# EAGLE design W707L (EAGLE 6.6.0)
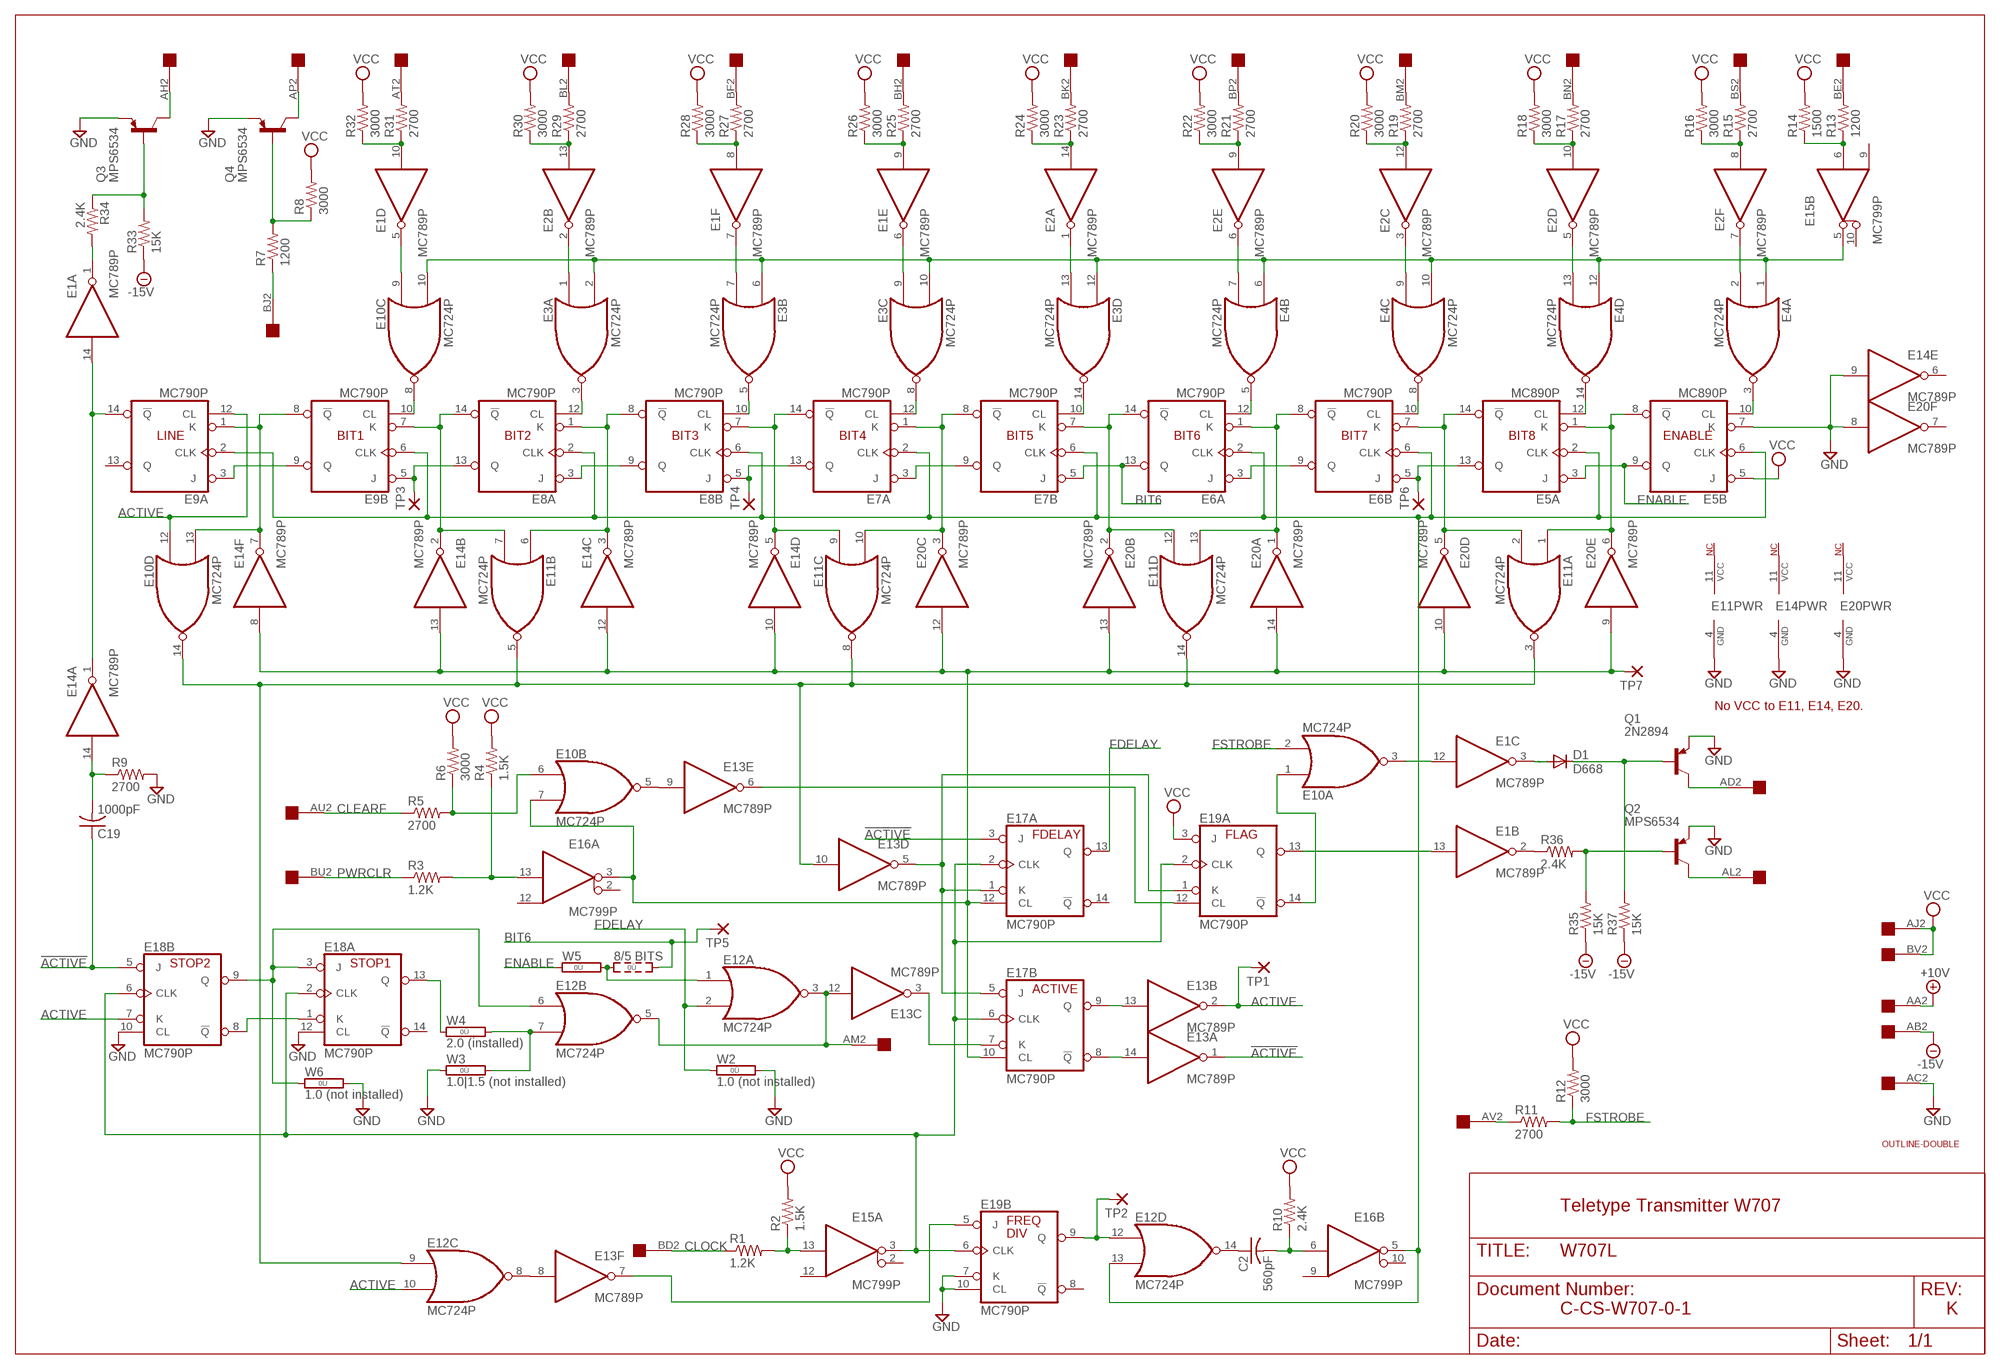
[diagram p0: schematic, sheet 1]

## Parts
C2  560pF  C-US050-025X075  [C050-025X075]
C19  1000pF  C-US050-025X075  [C050-025X075]
D1  D668  1N4148DO35-10  [DO35-10]
E1  MC789P  MC889P  [DIL14]
E2  MC789P  MC889P  [DIL14]
E3  MC724P  MC824P  [DIL14]
E4  MC724P  MC824P  [DIL14]
E5  MC890P  [DIL14]
E6  MC790P  MC890P  [DIL14]
E7  MC790P  MC890P  [DIL14]
E8  MC790P  MC890P  [DIL14]
E9  MC790P  MC890P  [DIL14]
E10  MC724P  MC824P  [DIL14]
E11  MC724P  MC824P  [DIL14]
E12  MC724P  MC824P  [DIL14]
E13  MC789P  MC889P  [DIL14]
E14  MC789P  MC889P  [DIL14]
E15  MC799P  MC899P  [DIL14]
E16  MC799P  MC899P  [DIL14]
E17  MC790P  MC890P  [DIL14]
E18  MC790P  MC890P  [DIL14]
E19  MC790P  MC890P  [DIL14]
E20  MC789P  MC889P  [DIL14]
Q1  2N2894  2N2904  [TO39]
Q2  MPS6534  2N2904  [TO39]
Q3  MPS6534  2N2904  [TO39]
Q4  MPS6534  2N2904  [TO39]
R1  1.2K  R-US_0207/10  [0207/10]
R2  1.5K  R-US_0207/10  [0207/10]
R3  1.2K  R-US_0207/10  [0207/10]
R4  1.5K  R-US_0207/10  [0207/10]
R5  2700  R-US_0207/10  [0207/10]
R6  3000  R-US_0207/10  [0207/10]
R7  1200  R-US_0207/10  [0207/10]
R8  3000  R-US_0207/10  [0207/10]
R9  2700  R-US_0207/10  [0207/10]
R10  2.4K  R-US_0207/10  [0207/10]
R11  2700  R-US_0207/10  [0207/10]
R12  3000  R-US_0207/10  [0207/10]
R13  1200  R-US_0207/10  [0207/10]
R14  1500  R-US_0207/10  [0207/10]
R15  2700  R-US_0207/10  [0207/10]
R16  3000  R-US_0207/10  [0207/10]
R17  2700  R-US_0207/10  [0207/10]
R18  3000  R-US_0207/10  [0207/10]
R19  2700  R-US_0207/10  [0207/10]
R20  3000  R-US_0207/10  [0207/10]
R21  2700  R-US_0207/10  [0207/10]
R22  3000  R-US_0207/10  [0207/10]
R23  2700  R-US_0207/10  [0207/10]
R24  3000  R-US_0207/10  [0207/10]
R25  2700  R-US_0207/10  [0207/10]
R26  3000  R-US_0207/10  [0207/10]
R27  2700  R-US_0207/10  [0207/10]
R28  3000  R-US_0207/10  [0207/10]
R29  2700  R-US_0207/10  [0207/10]
R30  3000  R-US_0207/10  [0207/10]
R31  2700  R-US_0207/10  [0207/10]
R32  3000  R-US_0207/10  [0207/10]
R33  15K  R-US_0207/10  [0207/10]
R34  2.4K  R-US_0207/10  [0207/10]
R35  15K  R-US_0207/10  [0207/10]
R36  2.4K  R-US_0207/10  [0207/10]
R37  15K  R-US_0207/10  [0207/10]
TP1  3,17/1,3  [3,17/1,3]
TP2  3,17/1,3  [3,17/1,3]
TP3  3,17/1,3  [3,17/1,3]
TP4  3,17/1,3  [3,17/1,3]
TP5  3,17/1,3  [3,17/1,3]
TP6  3,17/1,3  [3,17/1,3]
TP7  3,17/1,3  [3,17/1,3]
U$1  OUTLINE-DOUBLE  [DOUBLE]
U$2  DOUBLE  [EDGE-CON4]
W2  1.0 (not installed)  0R  [0R/10]
W3  1.0|1.5 (not installed)  0R  [0R/10]
W4  2.0 (installed)  0R  [0R/10]
W5  8/5 BITS  0R2  [0R2/10]
W6  1.0 (not installed)  0R  [0R/10]

## Nets
!ACTIVE: C19.1 E13.1(A:O) E17.3(A:J) E18.5(B:J)
+10V [Supply]: U$2.AA2
-15V [Supply]: R33.1 R35.1 R37.1 U$2.AB2
ACTIVE: E9.12(A:CL) E10.12(D:I0) E12.10(C:I1) E13.2(B:O) E18.7(B:K) TP1.1(P)
BIT6: E6.13(A:Q) E7.5(B:J) TP5.1(P) W5.3
CLEARF: R5.1 U$2.AU2
CLOCK: R1.1 U$2.BD2
ENABLE: E5.3(A:J) E5.9(B:Q) W5.1
FDELAY: E12.2(A:I1) E17.13(A:Q) W2.1
FSTROBE: E10.2(A:I1) R11.2 R12.1
GND [Supply]: E5.7(B:K) E11.4(PWR:GND) E14.4(PWR:GND) E14.9(E:I) E18.10(B:CL) E18.12(A:CL) E19.7(B:K) E19.10(B:CL) E20.4(PWR:GND) E20.8(F:I) Q1.1(E) Q2.1(E) Q3.1(E) Q4.1(E) R9.2 U$2.AC2 W2.2 W3.1 W6.2
N$1: E1.5(D:O) E10.9(C:I0)
N$2: E2.2(B:O) E3.1(A:I0)
N$3: E1.7(F:O) E3.7(B:I1)
N$4: E1.6(E:O) E3.9(C:I0)
N$5: E2.1(A:O) E3.13(D:I1)
N$6: E2.6(E:O) E4.7(B:I1)
N$7: E2.3(C:O) E4.9(C:I0)
N$8: E2.5(D:O) E4.13(D:I1)
N$9: E2.7(F:O) E4.2(A:I1)
N$10: R31.2 U$2.AT2
N$11: R29.2 U$2.BL2
N$12: R27.2 U$2.BF2
N$13: E1.10(D:I) R31.1 R32.1
N$14: E1.8(F:I) R27.1 R28.1
N$15: R25.2 U$2.BH2
N$16: E1.9(E:I) R25.1 R26.1
N$17: R23.2 U$2.BK2
N$18: E2.14(A:I) R23.1 R24.1
N$19: E2.9(E:I) R21.1 R22.1
N$20: R21.2 U$2.BP2
N$21: R19.2 U$2.BM2
N$22: R17.2 U$2.BN2
N$23: R15.2 U$2.BS2
N$24: E2.13(B:I) R29.1 R30.1
N$25: E15.3(A:O) E17.2(A:CLK) E17.6(B:CLK) E18.2(A:CLK) E18.6(B:CLK) E19.2(A:CLK) E19.6(B:CLK)
N$26: E2.12(C:I) R19.1 R20.1
N$27: E2.10(D:I) R17.1 R18.1
N$28: E2.8(F:I) R15.1 R16.1
N$29: R13.2 U$2.BE2
N$30: E15.6(B:I) R13.1 R14.1
N$31: E3.2(A:I1) E3.6(B:I0) E3.10(C:I1) E3.12(D:I0) E4.1(A:I0) E4.6(B:I0) E4.10(C:I1) E4.12(D:I0) E10.10(C:I1) E15.5(B:O)
N$32: E5.2(A:CLK) E5.6(B:CLK) E6.2(A:CLK) E6.6(B:CLK) E7.2(A:CLK) E7.6(B:CLK) E8.2(A:CLK) E8.6(B:CLK) E9.2(A:CLK) E9.6(B:CLK) E12.13(D:I1) E16.5(B:O)
N$33: E8.1(A:K) E8.8(B:!Q) E11.6(B:I0) E14.3(C:O)
N$34: E8.3(A:J) E8.9(B:Q)
N$35: E7.14(A:!Q) E8.7(B:K) E11.9(C:I0) E14.5(D:O)
N$36: E7.13(A:Q) E8.5(B:J) TP4.1(P)
N$37: E7.3(A:J) E7.9(B:Q)
N$38: E7.1(A:K) E7.8(B:!Q) E11.10(C:I1) E20.3(C:O)
N$39: E6.14(A:!Q) E7.7(B:K) E11.12(D:I0) E20.2(B:O)
N$40: E12.1(A:I0) W5.2
N$41: E6.1(A:K) E6.8(B:!Q) E11.13(D:I1) E20.1(A:O)
N$42: E6.3(A:J) E6.9(B:Q)
N$43: E5.14(A:!Q) E6.7(B:K) E11.2(A:I1) E20.5(D:O)
N$44: E5.13(A:Q) E6.5(B:J) TP6.1(P)
N$45: E5.1(A:K) E5.8(B:!Q) E11.1(A:I0) E20.6(E:O)
N$46: Q4.3(C) U$2.AP2
N$47: E4.3(A:O) E5.10(B:CL)
N$48: E3.14(D:O) E7.10(B:CL)
N$49: E4.5(B:O) E6.12(A:CL)
N$50: E4.8(C:O) E6.10(B:CL)
N$51: E4.14(D:O) E5.12(A:CL)
N$52: E3.8(C:O) E7.12(A:CL)
N$53: E13.7(F:O) E19.5(B:J)
N$54: E8.14(A:!Q) E9.7(B:K) E11.7(B:I1) E14.2(B:O)
N$55: E8.13(A:Q) E9.5(B:J) TP3.1(P)
N$56: E9.10(B:CL) E10.8(C:O)
N$57: E3.5(B:O) E8.10(B:CL)
N$58: E15.13(A:I) R1.2 R2.1
N$59: E16.13(A:I) R3.2 R4.1
N$60: E3.3(A:O) E8.12(A:CL)
N$61: E9.1(A:K) E9.8(B:!Q) E10.13(D:I1) E14.7(F:O)
N$62: E9.3(A:J) E9.9(B:Q)
N$63: E1.14(A:I) E9.14(A:!Q) E14.1(A:O)
N$64: E1.1(A:O) R34.2
N$65: Q3.2(B) R33.2 R34.1
N$66: E10.7(B:I1) E14.8(F:I) E14.10(D:I) E14.12(C:I) E14.13(B:I) E16.3(A:O) E17.10(B:CL) E17.12(A:CL) E20.9(E:I) E20.10(D:I) E20.12(C:I) E20.13(B:I) E20.14(A:I) TP7.1(P)
N$67: Q3.3(C) U$2.AH2
N$68: E10.14(D:O) E11.3(A:O) E11.5(B:O) E11.8(C:O) E11.14(D:O) E12.9(C:I0) E13.10(D:I)
N$69: E12.12(D:I0) E19.9(B:Q) TP2.1(P)
N$71: C2.1 E12.14(D:O)
N$72: C2.2 E16.6(B:I) R10.1
N$73: E12.8(C:O) E13.8(F:I)
N$74: E13.14(A:I) E17.8(B:!Q)
N$75: E13.13(B:I) E17.9(B:Q)
N$76: E18.13(A:Q) W4.1
N$77: E13.3(C:O) E17.7(B:K)
N$78: E12.3(A:O) E12.5(B:O) E13.12(C:I) U$2.AM2
N$79: Q4.2(B) R7.2 R8.1
N$80: E12.6(B:I0) E18.3(A:J) E18.9(B:Q) W6.1
N$81: E10.1(A:I0) E19.14(A:!Q)
N$82: E12.7(B:I1) W3.2 W4.2
N$83: R7.1 U$2.BJ2
N$84: R11.1 U$2.AV2
N$85: E10.5(B:O) E13.9(E:I)
N$86: Q2.2(B) R35.2 R36.2
N$87: Q2.3(C) U$2.AL2
N$88: Q1.3(C) U$2.AD2
N$89: D1.C Q1.2(B) R37.2
N$90: D1.A E1.3(C:O)
N$91: E1.2(B:O) R36.1
N$92: E1.12(C:I) E10.3(A:O)
N$93: C19.2 E14.14(A:I) R9.1
N$94: E13.5(D:O) E17.1(A:K) E17.5(B:J) E19.1(A:K)
N$96: E13.6(E:O) E19.12(A:CL)
N$97: E1.13(B:I) E19.13(A:Q)
N$98: E18.1(A:K) E18.8(B:!Q)
N$105: E10.6(B:I0) R5.2 R6.1
NC: E11.11(PWR:VCC) E14.11(PWR:VCC) E20.11(PWR:VCC)
PWRCLR: R3.1 U$2.BU2
VCC [Supply]: E5.5(B:J) E19.3(A:J) R2.2 R4.2 R6.2 R8.2 R10.2 R12.2 R14.2 R16.2 R18.2 R20.2 R22.2 R24.2 R26.2 R28.2 R30.2 R32.2 U$2.AJ2 U$2.BV2
Unconnected: E9.13(A:Q) E14.6(E:O) E15.2(A:E) E15.9(B:R) E15.10(B:E) E15.12(A:R) E16.2(A:E) E16.9(B:R) E16.10(B:E) E16.12(A:R) E17.14(A:!Q) E18.14(A:!Q) E19.8(B:!Q) E20.7(F:O) U$2.AA1 U$2.AB1 U$2.AC1 U$2.AD1 U$2.AE1 U$2.AE2 U$2.AF1 U$2.AF2 U$2.AH1 U$2.AJ1 U$2.AK1 U$2.AK2 U$2.AL1 U$2.AM1 U$2.AN1 U$2.AN2 U$2.AP1 U$2.AR1 U$2.AR2 U$2.AS1 U$2.AS2 U$2.AT1 U$2.AU1 U$2.AV1 U$2.BA1 U$2.BA2 U$2.BB1 U$2.BB2 U$2.BC1 U$2.BC2 U$2.BD1 U$2.BE1 U$2.BF1 U$2.BH1 U$2.BJ1 U$2.BK1 U$2.BL1 U$2.BM1 U$2.BN1 U$2.BP1 U$2.BR1 U$2.BR2 U$2.BS1 U$2.BT1 U$2.BT2 U$2.BU1 U$2.BV1

## Notes on the sheet
- LINE | BIT1 | BIT2 | BIT3 | BIT4 | BIT5 | BIT6 | BIT7 | BIT8 | ENABLE
- No VCC to E11, E14, E20.
- FDELAY | FLAG
- STOP2 | STOP1
- ACTIVE
- Teletype Transmitter W707
- FREQ
- DIV
- C-CS-W707-0-1 | K

## Power pins joined to a net without a drawn wire
GND: E1.4(PWR:GND) E2.4(PWR:GND) E3.4(PWR:GND) E4.4(PWR:GND) E5.4(PWR:GND) E6.4(PWR:GND) E7.4(PWR:GND) E8.4(PWR:GND) E9.4(PWR:GND) E10.4(PWR:GND) E12.4(PWR:GND) E13.4(PWR:GND) E15.4(PWR:GND) E16.4(PWR:GND) E17.4(PWR:GND) E18.4(PWR:GND) E19.4(PWR:GND)
VCC: E1.11(PWR:VCC) E2.11(PWR:VCC) E3.11(PWR:VCC) E4.11(PWR:VCC) E5.11(PWR:VCC) E6.11(PWR:VCC) E7.11(PWR:VCC) E8.11(PWR:VCC) E9.11(PWR:VCC) E10.11(PWR:VCC) E12.11(PWR:VCC) E13.11(PWR:VCC) E15.11(PWR:VCC) E16.11(PWR:VCC) E17.11(PWR:VCC) E18.11(PWR:VCC) E19.11(PWR:VCC)

## Library data of the parts
C2 C19 = rcl:C-US: CAPACITOR, American symbol
D1 = diode:1N4148: DIODE high speed (Philips)
E1 E2 E13 E14 E20 = dec-con:MC889: RTL Hex Inverter
E3 E4 E10-E12 = dec-con:MC824: RTL Quad NOR Gate
E5-E9 E17-E19 = dec-con:MC890: RTL Dual JK Flip-Flop
E15 E16 = dec-con:MC899: RTL Dual Buffer
Q1-Q4 = transistor-pnp:2N2904*: PNP Transistror
R1-R37 = rcl:R-US_: RESISTOR, American symbol
TP1-TP7 = wirepad:3,17/1,3: THROUGH-HOLE PAD
U$1 = dec-con:OUTLINE-*: Board outlines for DEC boards.
U$2 = dec-con:DOUBLE: Double-Height DEC board
W2-W4 W6 = jumper:0R: Bridge 0R 10mm
W5 = jumper:0R2: Bridge switch 0R 2 x 10mm

## Net classes
1 Supply: width 0.813 mm

## Board
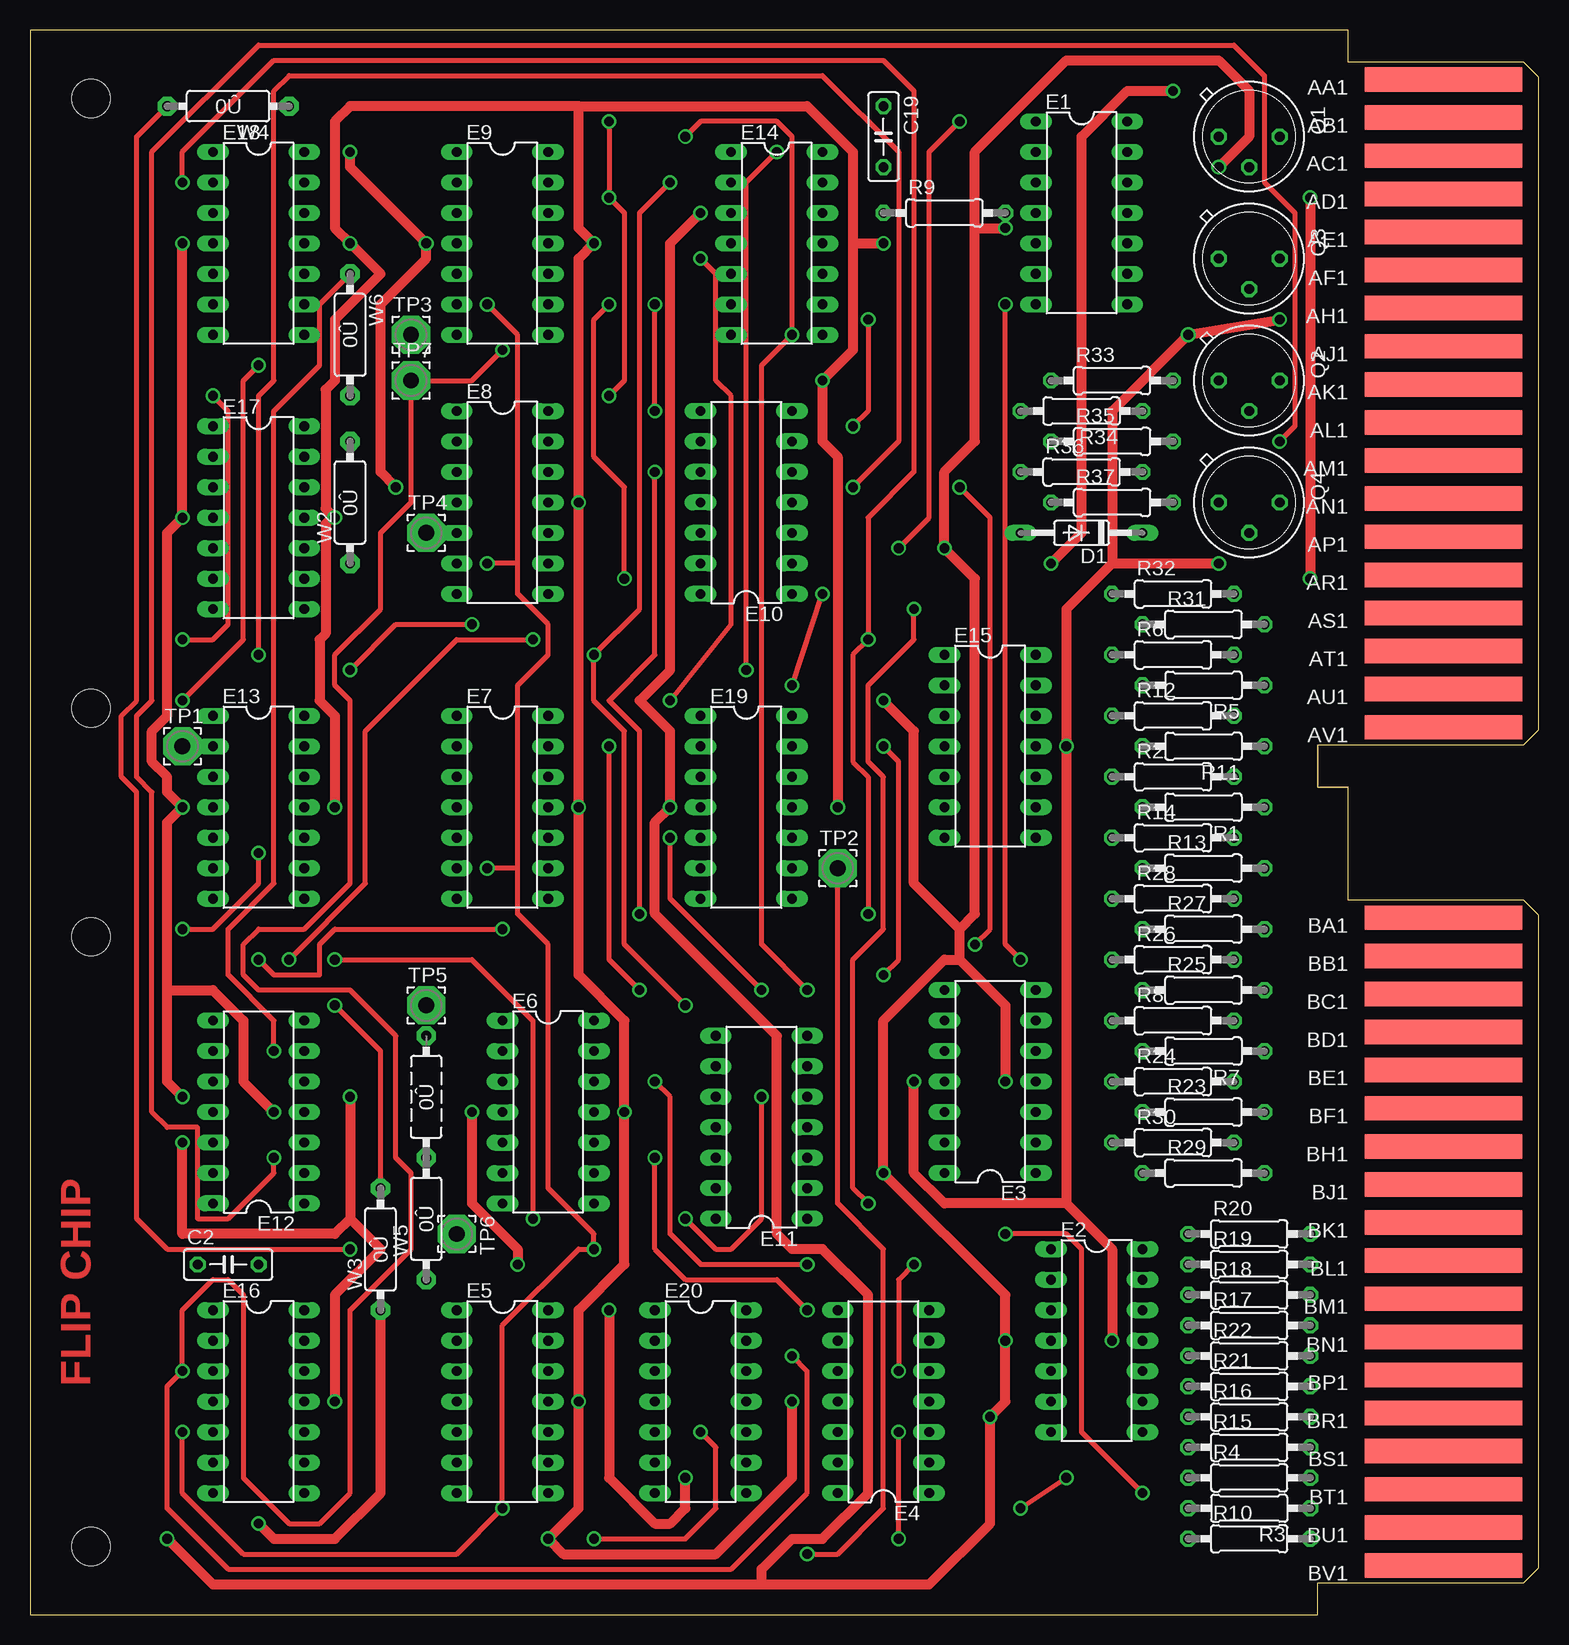
[diagram p1: board, top side]
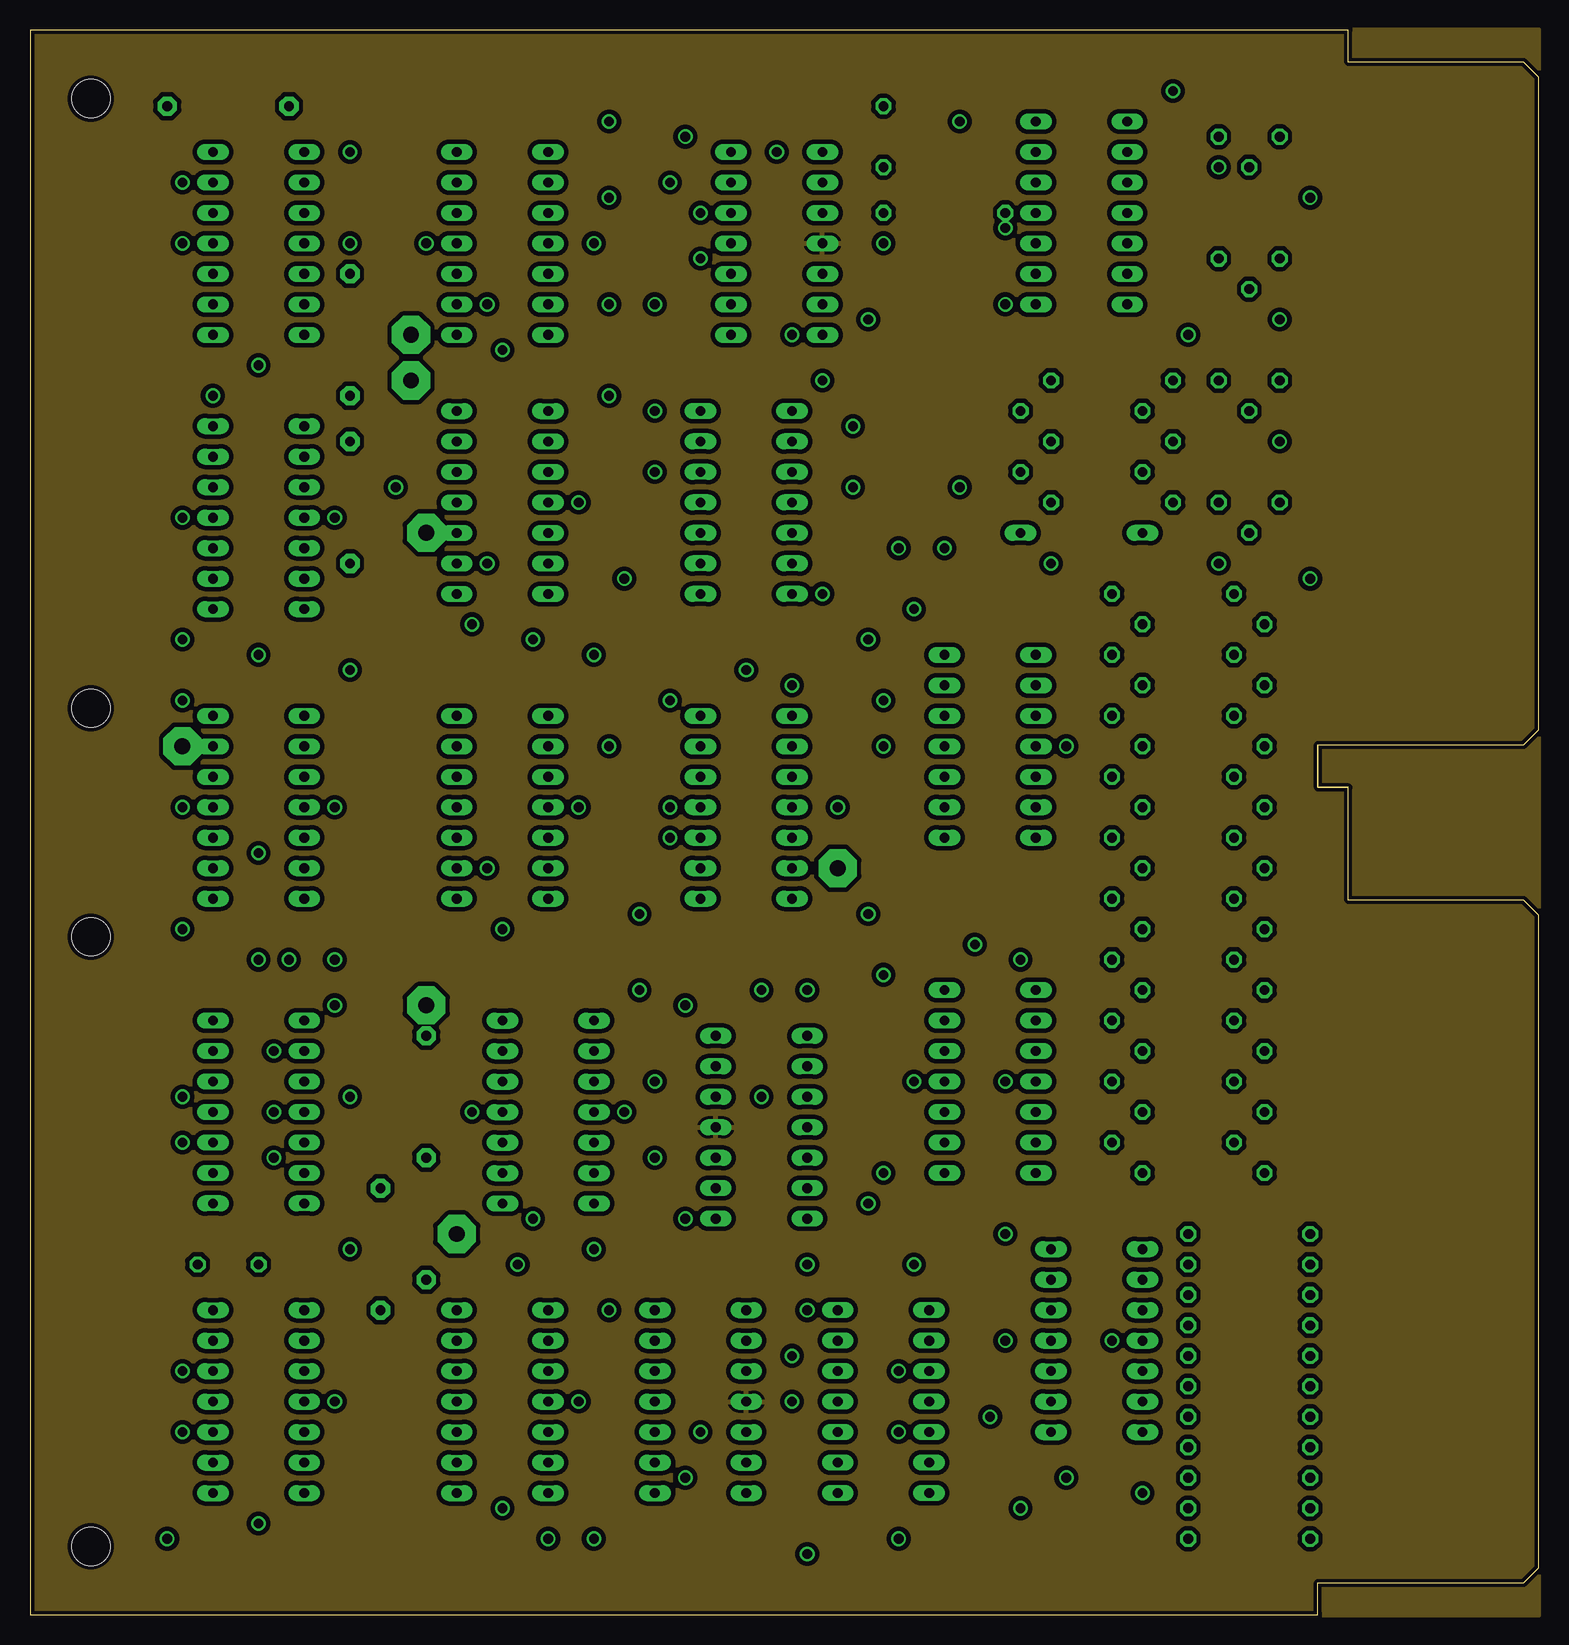
[diagram p2: board, inner layer NC$]
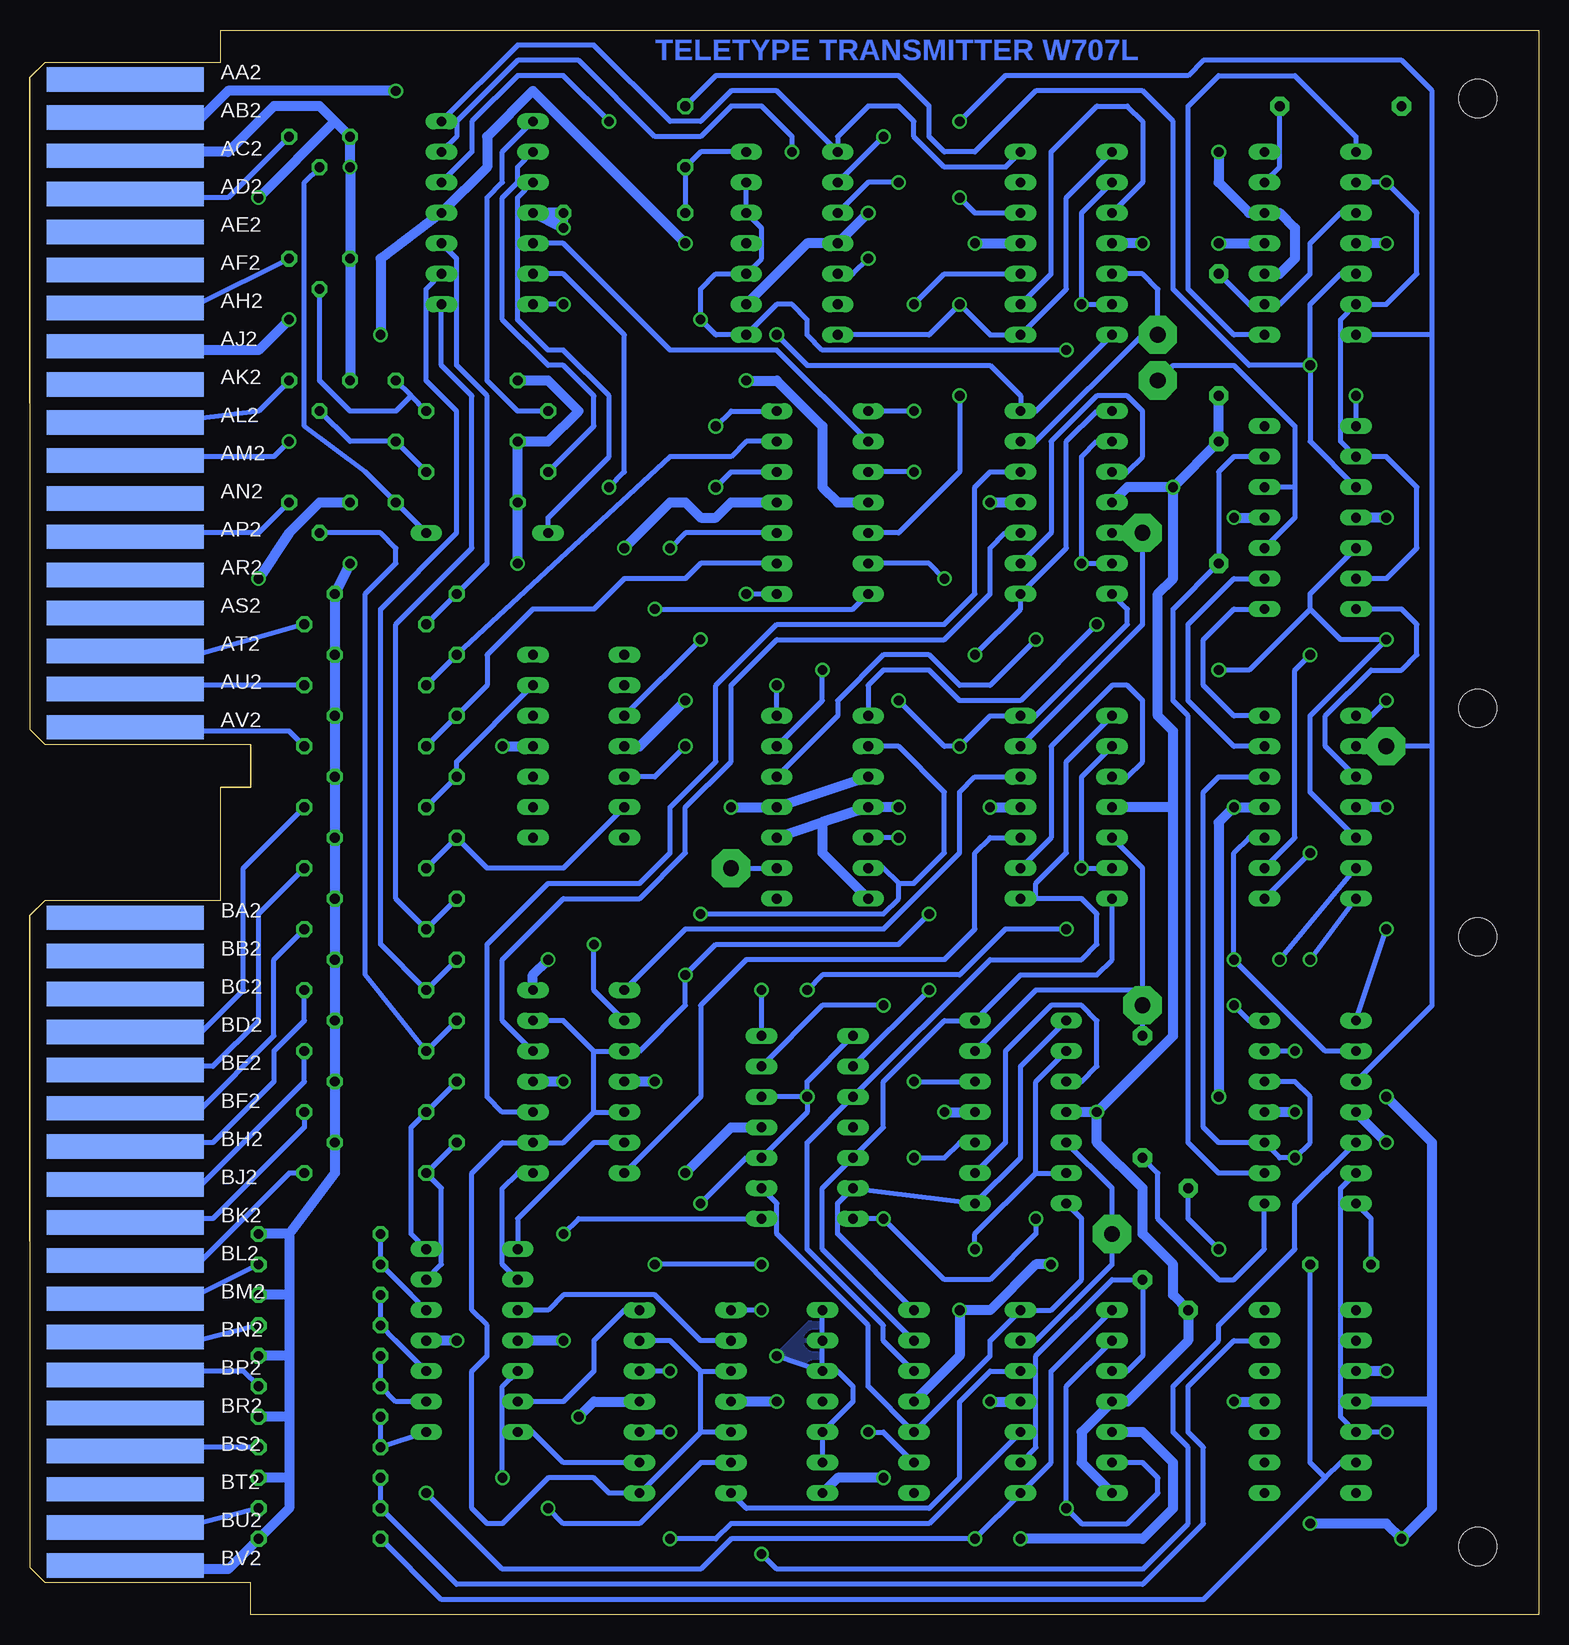
[diagram p3: board, bottom side, seen from below]

Size 125.73 x 132.08 mm. Coordinates in mm from the lower left corner, seen from the top.
Copper layers (1+2+16): Top 0.035mm / dielectric 1.5mm / NC$ 0.035mm / dielectric 0.15mm / Bottom 0.035mm
Design rules "16mils *": minimum track width 16mil, minimum drill 32mil, track to track 15mil, track to pad 10mil, pad to pad 10mil, via to via 10mil, smd to smd 10mil, copper to edge 13mil, drill to drill 10mil, minimum pad ring 10mil, minimum via ring 8mil, stop-mask expansion 0mil, vias tented up to drill 0mil, thermal gap 10mil

### Footprints (pad centres in the part's own frame; a part is rotated, then mirrored left to right if it is on the bottom)
C050-025X075 = drill 0.813 octagon: 1 -2.54,0; 2 2.54,0
DO35-10 = drill 0.813 long: A 5.08,0; C -5.08,0
DIL14 = drill 0.813 long: 1 -7.62,-3.81; 2 -5.08,-3.81; 3 -2.54,-3.81; 4 0,-3.81; 5 2.54,-3.81; 6 5.08,-3.81; 7 7.62,-3.81; 8 7.62,3.81; 9 5.08,3.81; 10 2.54,3.81; 11 0,3.81; 12 -2.54,3.81; 13 -5.08,3.81; 14 -7.62,3.81
TO39 = drill 0.813 octagon: 1 0,-2.54; 2 2.54,0; 3 0,2.54
0207/10 = drill 0.813 octagon: 1 -5.08,0; 2 5.08,0
3,17/1,3 = drill 1.321 pad 3.175 octagon: 1 0,0
DOUBLE = hole 3.175: 120.65,56.515; 120.65,5.715; 120.65,75.565; 120.65,126.365
EDGE-CON4 = smd 13.106 x 2.032: AA1 7.938,4.128; AB1 7.938,7.303; AC1 7.938,10.477; AD1 7.938,13.652; AE1 7.938,16.828; AF1 7.938,20.003; AH1 7.938,23.177; AJ1 7.938,26.352; AK1 7.938,29.527; AL1 7.938,32.703; AM1 7.938,35.877; AN1 7.938,39.053; AP1 7.938,42.227; AR1 7.938,45.403; AS1 7.938,48.578; AT1 7.938,51.752; AU1 7.938,54.928; AV1 7.938,58.102; BA1 7.938,73.978; BB1 7.938,77.153; BC1 7.938,80.328; BD1 7.938,83.502; BE1 7.938,86.677; BF1 7.938,89.853; BH1 7.938,93.028; BJ1 7.938,96.203; BK1 7.938,99.377; BL1 7.938,102.552; BM1 7.938,105.728; BN1 7.938,108.903; BP1 7.938,112.078; BR1 7.938,115.252; BS1 7.938,118.427; BT1 7.938,121.603; BU1 7.938,124.778; BV1 7.938,127.953 | smd 13.106 x 2.032 bottom: AA2 7.938,4.128; AB2 7.938,7.303; AC2 7.938,10.477; AD2 7.938,13.652; AE2 7.938,16.828; AF2 7.938,20.003; AH2 7.938,23.177; AJ2 7.938,26.352; AK2 7.938,29.527; AL2 7.938,32.703; AM2 7.938,35.877; AN2 7.938,39.053; AP2 7.938,42.227; AR2 7.938,45.403; AS2 7.938,48.578; AT2 7.938,51.752; AU2 7.938,54.928; AV2 7.938,58.102; BA2 7.938,73.978; BB2 7.938,77.153; BC2 7.938,80.328; BD2 7.938,83.502; BE2 7.938,86.677; BF2 7.938,89.853; BH2 7.938,93.028; BJ2 7.938,96.203; BK2 7.938,99.377; BL2 7.938,102.552; BM2 7.938,105.728; BN2 7.938,108.903; BP2 7.938,112.078; BR2 7.938,115.252; BS2 7.938,118.427; BT2 7.938,121.603; BU2 7.938,124.778; BV2 7.938,127.953
0R/10 = drill 0.813 pad 1.6 octagon: 1 -5.08,0; 2 5.08,0
0R2/10 = drill 0.813 pad 1.6 octagon: 1 -5.08,0; 2 5.08,0; 3 15.24,0

### Placement (x,y rotation side)
C2  16.51,29.21 0 top
C19  71.12,123.19 270 top
D1  87.63,90.17 180 top
E1  87.63,116.84 270 top
E2  88.9,22.86 270 top
E3  80.01,44.45 90 top
E4  71.12,17.78 90 top
E5  39.37,17.78 270 top
E6  43.18,41.91 270 top
E7  39.37,67.31 270 top
E8  39.37,92.71 270 top
E9  39.37,114.3 270 top
E10  59.69,92.71 90 top
E11  60.96,40.64 90 top
E12  19.05,41.91 90 top
E13  19.05,67.31 270 top
E14  62.23,114.3 270 top
E15  80.01,72.39 270 top
E16  19.05,17.78 270 top
E17  19.05,91.44 270 top
E18  19.05,114.3 270 top
E19  59.69,67.31 270 top
E20  55.88,17.78 270 top
Q1  101.6,123.19 270 top
Q2  101.6,102.87 270 top
Q3  101.6,113.03 270 top
Q4  101.6,92.71 270 top
R1  97.79,67.31 180 top
R2  95.25,69.85 0 top
R3  101.6,8.89 180 top
R4  101.6,11.43 0 top
R5  97.79,77.47 180 top
R6  95.25,80.01 0 top
R7  97.79,46.99 180 top
R8  95.25,49.53 0 top
R9  76.2,116.84 0 top
R10  101.6,6.35 0 top
R11  97.79,72.39 180 top
R12  95.25,74.93 0 top
R13  97.79,62.23 0 top
R14  95.25,64.77 0 top
R15  101.6,13.97 0 top
R16  101.6,16.51 0 top
R17  101.6,24.13 0 top
R18  101.6,26.67 0 top
R19  101.6,29.21 0 top
R20  101.6,31.75 0 top
R21  101.6,19.05 0 top
R22  101.6,21.59 0 top
R23  97.79,41.91 0 top
R24  95.25,44.45 0 top
R25  97.79,52.07 0 top
R26  95.25,54.61 0 top
R27  97.79,57.15 0 top
R28  95.25,59.69 0 top
R29  97.79,36.83 0 top
R30  95.25,39.37 0 top
R31  97.79,82.55 0 top
R32  95.25,85.09 0 top
R33  90.17,102.87 0 top
R34  87.63,100.33 180 top
R35  90.17,97.79 0 top
R36  87.63,95.25 0 top
R37  90.17,92.71 0 top
TP1  12.7,72.39 0 top
TP2  67.31,62.23 0 top
TP3  31.75,106.68 0 top
TP4  33.02,90.17 0 top
TP5  33.02,50.8 0 top
TP6  35.56,31.75 270 top
TP7  31.75,102.87 0 top
U$1  125.73,132.08 180 top
U$2  125.73,132.08 180 top
U$3  [FLIPCHIP]  0,0 0 top
W2  26.67,92.71 90 top
W3  29.21,30.48 90 top
W4  16.51,125.73 180 top
W5  33.02,33.02 90 top
W6  26.67,106.68 270 top

### Tracks (layer width: path | path; a pad name or v marks a point on that pad's centre or on a via)
!ACTIVE  (via drill 0.81)
  Top 0.406: v12.7,76.2 17.78,81.28 17.78,102.87 v19.05,104.14
  Bottom 0.406: E13.1 13.97,74.93 v12.7,76.2 | v19.05,104.14 19.05,109.22 16.51,111.76 E18.5 | E17.3 19.05,97.79 v19.05,104.14 | C19.1 68.58,128.27 53.34,128.27 50.8,125.73 50.8,123.19 49.53,121.92 46.99,121.92 41.91,127 33.02,127 30.48,124.46 30.48,110.49 24.13,104.14 v19.05,104.14
-15V  (via drill 0.81)
  Top 0.813: v95.25,127 91.44,127 87.63,123.19 87.63,90.17 v85.09,87.63
  Bottom 0.813: U$2.AB2 117.13,124.75 116.84,124.46 111.76,124.46 109.22,127 v95.25,127 | v85.09,87.63 R37.1 R35.1 82.55,97.79 80.01,100.33 82.55,102.87 R33.1
ACTIVE  (via drill 0.81)
  Top 0.406: v48.26,124.46 v48.26,118.11 49.53,116.84 49.53,102.87 v48.26,101.6
  Bottom 0.406: E12.10 8.89,50.8 8.89,72.39 | TP1.1 E13.2 TP1.1 | 8.89,106.68 E18.7 | 8.89,72.39 8.89,106.68 | 8.89,72.39 TP1.1 | E9.12 46.99,116.84 v48.26,118.11 | v48.26,124.46 44.45,128.27 29.21,128.27 27.94,129.54 11.43,129.54 8.89,127 8.89,106.68 | E10.12 53.34,90.17 48.26,95.25 v48.26,101.6
BIT6
  Bottom 0.406: E6.13 41.91,52.07 33.02,52.07 | 33.02,52.07 TP5.1 W5.3 | 33.02,52.07 33.02,62.23 E7.5
CLEARF
  Bottom 0.406: U$2.AU2 117.2,77.11 116.84,77.47 R5.1
CLOCK
  Bottom 0.406: U$2.BD2 117.14,48.56 116.84,48.26 111.76,48.26 107.95,52.07 107.95,62.23 R1.1
ENABLE
  Bottom 0.406: E5.3 34.29,20.32 33.02,21.59 W5.1 35.56,27.94 41.91,21.59 41.91,13.97 E5.9
FDELAY
  Bottom 0.406: E12.2 26.67,36.83 29.21,39.37 29.21,74.93 30.48,76.2 30.48,83.82 W2.1 26.67,95.25 25.4,96.52 E17.13
FSTROBE
  Bottom 0.406: R11.2 R12.1 87.63,77.47 87.63,80.01 83.82,83.82 78.74,83.82 76.2,86.36 71.12,86.36 69.85,87.63 E10.2
GND  (via drill 0.81)
  Top 0.813: v99.06,120.65 101.6,123.19 101.6,127 99.06,129.54 86.36,129.54 78.74,121.92 78.74,115.57 | v106.68,118.11 v106.68,86.36 | 78.74,115.57 v81.28,115.57 | v11.43,6.35 15.24,2.54 60.96,2.54 | 60.96,2.54 74.93,2.54 80.01,7.62 v80.01,16.51 81.28,17.78 v81.28,22.86 81.28,26.67 v71.12,36.83 71.12,49.53 76.2,54.61 77.47,54.61 | v12.7,114.3 v12.7,91.44 11.43,90.17 11.43,74.93 10.16,73.66 10.16,71.12 11.43,69.85 11.43,68.58 v12.7,67.31 11.43,66.04 11.43,52.07 | v26.67,121.92 26.67,120.65 v33.02,114.3 33.02,113.03 29.21,109.22 29.21,95.25 v30.48,93.98 | v48.26,25.4 48.26,11.43 52.07,7.62 53.34,7.62 54.61,8.89 v54.61,11.43 | v19.05,7.62 20.32,6.35 25.4,6.35 29.21,10.16 W3.1 | 11.43,52.07 11.43,44.45 v12.7,43.18 | 11.43,52.07 15.24,52.07 17.78,49.53 17.78,44.45 v20.32,41.91 | v40.64,29.21 40.64,30.48 36.83,34.29 v36.83,41.91 | v81.28,44.45 81.28,50.8 77.47,54.61 | 77.47,54.61 77.47,57.15 | 77.47,57.15 78.74,58.42 78.74,86.36 v76.2,88.9 76.2,95.25 78.74,97.79 78.74,115.57 | v71.12,76.2 73.66,73.66 73.66,60.96 77.47,57.15 | v55.88,116.84 53.34,114.3 53.34,78.74 50.8,76.2 53.34,73.66 v53.34,67.31 52.07,66.04 52.07,58.42 62.23,48.26 62.23,31.75 63.5,30.48 66.04,30.48 69.85,26.67 69.85,10.16 66.04,6.35 63.5,6.35 60.96,3.81 60.96,2.54
  Bottom 0.813: U$2.AC2 117.17,121.59 116.84,121.92 109.22,121.92 105.41,125.73 101.6,125.73 100.33,124.46 | 100.33,124.46 Q1.1 v99.06,120.65 Q3.1 Q2.1 | 100.33,124.46 v106.68,118.11 | Q4.1 101.6,92.71 104.14,90.17 v106.68,86.36 | v81.28,115.57 E1.4 82.55,116.84 | R9.2 82.55,116.84 | v81.28,115.57 R9.2 | v81.28,115.57 R9.2 | 8.89,17.78 E16.4 | E4.4 78.74,17.78 v80.01,16.51 | v81.28,22.86 E2.4 | E11.4 67.31,40.64 v71.12,36.83 | E20.4 48.26,21.59 v48.26,25.4 45.72,25.4 41.91,29.21 v40.64,29.21 | v12.7,91.44 E17.4 | v12.7,114.3 E18.4 | v26.67,121.92 26.67,119.38 24.13,116.84 E18.12 21.59,116.84 20.32,115.57 20.32,113.03 21.59,111.76 E18.10 | v33.02,114.3 E9.4 | v36.83,41.91 E6.4 | v36.83,41.91 36.83,39.37 33.02,35.56 33.02,31.75 30.48,29.21 30.48,26.67 W3.1 29.21,22.86 34.29,17.78 E5.4 38.1,15.24 38.1,12.7 E5.7 | E15.4 74.93,72.39 v71.12,76.2 | E8.4 34.29,93.98 v30.48,93.98 | v30.48,93.98 W2.2 W6.2 | E14.9 60.96,114.3 E14.4 v55.88,116.84 | v20.32,41.91 E12.4 | v12.7,67.31 E13.4 | 59.69,66.04 E19.4 v53.34,67.31 | 59.69,66.04 E19.10 | E19.7 59.69,63.5 59.69,66.04 | v30.48,93.98 30.48,86.36 31.75,85.09 31.75,74.93 30.48,73.66 30.48,67.31 | 30.48,67.31 E7.4 | v36.83,41.91 30.48,48.26 30.48,67.31 | v81.28,44.45 E3.4 | E10.4 67.31,92.71 68.58,91.44 69.85,91.44 71.12,92.71 72.39,92.71 v76.2,88.9 | E20.8 58.42,11.43 v54.61,11.43 | v19.05,7.62 12.7,7.62 v11.43,6.35 8.89,8.89 8.89,17.78 | v81.28,115.57 82.55,116.84 | v12.7,43.18 8.89,39.37 8.89,17.78
N$1
  Bottom 0.406: E10.9 63.5,105.41 72.39,105.41 81.28,114.3 E1.5
N$2
  Bottom 0.406: E2.2 86.36,29.21 86.36,35.56 85.09,36.83 E3.1
N$3  (via drill 0.81)
  Top 0.406: v82.55,54.61 81.28,55.88 v81.28,109.22
  Bottom 0.406: v81.28,109.22 E1.7
  Bottom 0.813: E3.7 83.82,53.34 v82.55,54.61
N$4  (via drill 0.81)
  Top 0.406: v78.74,55.88 80.01,57.15 80.01,91.44 v77.47,93.98
  Bottom 0.406: E3.9 78.74,52.07 v78.74,55.88 | E1.6 81.28,111.76 76.2,106.68 76.2,95.25 v77.47,93.98
N$5
  Bottom 0.406: E2.1 85.09,33.02 78.74,39.37 E3.13
N$6
  Bottom 0.406: E4.7 76.2,25.4 78.74,22.86 78.74,20.32 81.28,17.78 E2.6
N$7
  Bottom 0.406: E2.3 82.55,25.4 81.28,26.67 73.66,26.67 69.85,22.86 E4.9
N$8  (via drill 0.81)
  Top 0.406: v82.55,8.89 v86.36,11.43
  Bottom 0.406: E4.13 69.85,12.7 74.93,7.62 81.28,7.62 v82.55,8.89 | E2.5 86.36,19.05 v86.36,11.43
N$9
  Bottom 0.406: E4.2 81.28,12.7 83.82,15.24 E2.7
N$10
  Bottom 0.406: U$2.AT2 117.17,80.34 116.84,80.01 111.76,80.01 R31.2
N$11
  Bottom 0.406: U$2.BL2 117.17,29.54 116.84,29.21 111.76,29.21 104.14,36.83 R29.2
N$12
  Bottom 0.406: U$2.BF2 117.12,42.19 116.84,41.91 111.76,41.91 105.41,48.26 105.41,54.61 R27.2
N$13
  Bottom 0.406: R31.1 R32.1 87.63,87.63 87.63,101.6 90.17,104.14 90.17,113.03 E1.10
N$14
  Bottom 0.406: R28.1 R27.1 95.25,59.69 95.25,82.55 88.9,88.9 88.9,101.6 91.44,104.14 E1.8
N$15
  Bottom 0.406: U$2.BH2 117.17,39.04 116.84,39.37 110.49,39.37 105.41,44.45 105.41,46.99 102.87,49.53 R25.2
N$16
  Bottom 0.406: R26.1 R25.1 96.52,55.88 96.52,83.82 90.17,90.17 90.17,100.33 92.71,102.87 92.71,110.49 E1.9
N$17
  Bottom 0.406: U$2.BK2 117.14,32.72 116.84,33.02 110.49,33.02 102.87,40.64 R23.2
N$18
  Bottom 0.406: R24.1 R23.1 93.98,40.64 93.98,31.75 E2.14
N$19
  Bottom 0.406: R22.1 R21.1 95.25,17.78 E2.9
N$20
  Bottom 0.406: U$2.BP2 117.17,19.99 116.84,20.32 107.95,20.32 R21.2
N$21
  Bottom 0.406: U$2.BM2 117.17,26.34 116.84,26.67 111.76,26.67 R19.2
N$22
  Bottom 0.406: U$2.BN2 117.17,23.19 116.84,22.86 111.76,22.86 R17.2
N$23
  Bottom 0.406: U$2.BS2 117.14,13.66 116.84,13.97 R15.2
N$24
  Bottom 0.406: R30.1 R29.1 91.44,35.56 91.44,29.21 E2.13
N$25  (via drill 0.81)
  Top 0.406: v69.85,58.42 69.85,69.85 68.58,71.12 68.58,80.01 v69.85,81.28 69.85,91.44 73.66,95.25 73.66,127 71.12,129.54 20.32,129.54 12.7,121.92 v12.7,119.38
  Bottom 0.406: E18.2 v12.7,119.38 10.16,116.84 10.16,111.76 12.7,109.22 E18.6 16.51,107.95 16.51,97.79 E17.2 12.7,96.52 10.16,93.98 10.16,88.9 12.7,86.36 E17.6 | E19.6 54.61,62.23 53.34,60.96 | 53.34,60.96 52.07,60.96 49.53,63.5 49.53,68.58 53.34,72.39 E19.2 | 53.34,60.96 53.34,59.69 54.61,58.42 v69.85,58.42 | v69.85,81.28 E15.3
N$26
  Bottom 0.406: R20.1 R19.1 93.98,26.67 E2.12
N$27
  Bottom 0.406: R18.1 R17.1 95.25,22.86 E2.10
N$28
  Bottom 0.406: R16.1 R15.1 E2.8
N$29
  Bottom 0.406: U$2.BE2 117.17,45.39 116.84,45.72 110.49,45.72 106.68,49.53 106.68,58.42 R13.2
N$30
  Bottom 0.406: R13.1 R14.1 87.63,62.23 81.28,62.23 E15.6
N$31  (via drill 0.81)
  Top 0.406: v71.12,72.39 72.39,71.12 72.39,54.61 v71.12,53.34 | v52.07,95.25 52.07,80.01 48.26,76.2 50.8,73.66 v50.8,58.42
  Bottom 0.406: 69.85,15.24 E4.1 77.47,10.16 78.74,11.43 82.55,11.43 86.36,7.62 87.63,7.62 88.9,8.89 88.9,20.32 87.63,21.59 87.63,24.13 88.9,25.4 88.9,36.83 86.36,39.37 E3.2 81.28,39.37 78.74,41.91 | E4.12 69.85,15.24 | E15.5 73.66,69.85 v71.12,72.39 | 78.74,41.91 E3.12 | 78.74,46.99 E3.10 74.93,46.99 71.12,50.8 v71.12,53.34 68.58,55.88 53.34,55.88 v50.8,58.42 | 78.74,41.91 78.74,46.99 | E3.6 81.28,49.53 78.74,46.99 | v52.07,95.25 E10.10 | E4.6 72.39,22.86 69.85,20.32 | 69.85,20.32 E4.10 | 69.85,15.24 69.85,20.32
N$32  (via drill 0.81)
  Top 0.406: v12.7,15.24 12.7,10.16 17.78,5.08 35.56,5.08 v39.37,8.89 39.37,24.13 45.72,30.48 v46.99,30.48 46.99,31.75 43.18,35.56 43.18,55.88 40.64,58.42 40.64,62.23 | v38.1,109.22 40.64,106.68 40.64,87.63 | 40.64,62.23 40.64,77.47 43.18,80.01 43.18,82.55 40.64,85.09 40.64,87.63 | 40.64,87.63 v38.1,87.63 | 40.64,62.23 v38.1,62.23
  Bottom 0.406: E5.6 33.02,12.7 31.75,11.43 31.75,10.16 34.29,7.62 38.1,7.62 v39.37,8.89 39.37,19.05 E5.2 | E12.13 16.51,35.56 16.51,16.51 E16.5 v12.7,15.24 | E7.2 38.1,69.85 v38.1,62.23 E7.6 | E6.2 41.91,44.45 41.91,36.83 | 41.91,36.83 E6.6 | 41.91,36.83 46.99,31.75 v46.99,30.48 | E8.2 36.83,97.79 38.1,96.52 v38.1,87.63 E8.6 | E9.2 38.1,116.84 v38.1,109.22 E9.6
N$33  (via drill 0.81)
  Top 0.406: v54.61,50.8 49.53,55.88 49.53,73.66 46.99,76.2 v46.99,80.01 50.8,83.82 50.8,116.84 v53.34,119.38
  Bottom 0.406: E14.3 55.88,119.38 v53.34,119.38 | E11.6 59.69,50.8 v54.61,50.8 | E8.1 36.83,100.33 39.37,97.79 39.37,88.9 E8.8 43.18,83.82 v46.99,80.01
N$34
  Bottom 0.406: E8.3 34.29,95.25 33.02,96.52 33.02,100.33 34.29,101.6 36.83,101.6 40.64,97.79 40.64,90.17 E8.9
N$35  (via drill 0.81)
  Top 0.406: v50.8,52.07 48.26,54.61 v48.26,72.39 | v53.34,76.2 58.42,82.55 58.42,101.6 57.15,102.87 57.15,111.76 v55.88,113.03
  Bottom 0.406: E14.5 57.15,111.76 v55.88,113.03 | E11.9 v50.8,52.07 | E8.7 34.29,83.82 34.29,82.55 41.91,74.93 E7.14 45.72,74.93 v48.26,72.39 49.53,72.39 v53.34,76.2
N$36
  Bottom 0.406: E8.5 TP4.1 33.02,82.55 E7.13
N$37
  Bottom 0.406: E7.3 34.29,69.85 33.02,71.12 33.02,76.2 34.29,77.47 35.56,77.47 40.64,72.39 40.64,64.77 E7.9
N$38
  Bottom 0.406: E20.3 54.61,22.86 54.61,24.13 60.96,30.48 60.96,39.37 E11.10 45.72,54.61 38.1,54.61 36.83,55.88 36.83,58.42 38.1,59.69 41.91,59.69 | E7.1 39.37,71.12 39.37,63.5 41.91,60.96 41.91,59.69 | 41.91,59.69 E7.8
N$39
  Bottom 0.406: E20.2 59.69,30.48 59.69,35.56 E11.12 54.61,40.64 54.61,44.45 49.53,49.53 E6.14 43.18,53.34 36.83,53.34 35.56,54.61 E7.7
N$40
  Bottom 0.406: E12.1 22.86,30.48 25.4,27.94 26.67,27.94 31.75,33.02 31.75,36.83 W5.2
N$41
  Bottom 0.406: E20.1 58.42,31.75 58.42,34.29 E11.13 E6.8 43.18,38.1 43.18,45.72 E6.1
N$42
  Bottom 0.406: E6.3 38.1,44.45 36.83,45.72 36.83,49.53 38.1,50.8 40.64,50.8 44.45,46.99 44.45,39.37 E6.9
N$43
  Bottom 0.406: E6.7 38.1,33.02 38.1,27.94 40.64,25.4 E5.14 45.72,22.86 45.72,21.59 E20.5 55.88,19.05 55.88,24.13 63.5,31.75 63.5,34.29 E11.2
N$44
  Bottom 0.406: E5.13 41.91,22.86 35.56,29.21 TP6.1 35.56,35.56 E6.5
N$45  (via drill 0.81)
  Top 0.406: v92.71,10.16 87.63,15.24 87.63,30.48 86.36,31.75 v81.28,31.75 | v46.99,6.35 54.61,6.35 57.15,8.89 57.15,13.97 v55.88,15.24
  Bottom 0.406: E5.1 40.64,20.32 40.64,12.7 E5.8 v46.99,6.35 67.31,6.35 69.85,3.81 86.36,3.81 v92.71,10.16 | E11.1 80.01,33.02 v81.28,31.75 | E20.6 54.61,15.24 v55.88,15.24
N$46
  Bottom 0.406: U$2.AP2 117.17,89.84 116.84,90.17 106.68,90.17 Q4.3
N$47  (via drill 0.81)
  Top 0.406: v72.39,6.35 v72.39,15.24
  Bottom 0.406: E5.10 50.8,7.62 67.31,7.62 68.58,6.35 v72.39,6.35 | v72.39,15.24 E4.3
N$48
  Bottom 0.406: E7.10 45.72,64.77 46.99,63.5 46.99,57.15 49.53,54.61 66.04,54.61 69.85,50.8 69.85,43.18 E3.14
N$49  (via drill 0.81)
  Top 0.406: v52.07,44.45 53.34,43.18 53.34,31.75 55.88,29.21 v64.77,29.21 | v72.39,20.32 72.39,27.94 v73.66,29.21
  Bottom 0.406: v52.07,44.45 E6.12 | v72.39,20.32 E4.5 | v64.77,29.21 v73.66,29.21
N$50  (via drill 0.81)
  Top 0.406: v64.77,25.4 62.23,27.94 54.61,27.94 52.07,30.48 v52.07,38.1
  Bottom 0.406: v64.77,25.4 E4.8 | E6.10 48.26,39.37 49.53,38.1 v52.07,38.1
N$51
  Bottom 0.406: E5.12 45.72,20.32 48.26,17.78 48.26,11.43 50.8,8.89 66.04,8.89 E4.14
N$52
  Bottom 0.406: E3.8 71.12,57.15 54.61,57.15 48.26,63.5 48.26,68.58 46.99,69.85 E7.12
N$53  (via drill 0.81)
  Top 0.406: v19.05,54.61 20.32,53.34 24.13,53.34 24.13,55.88 25.4,57.15 v39.37,57.15 | v60.96,52.07 53.34,59.69 v53.34,64.77
  Bottom 0.406: v39.37,57.15 44.45,57.15 48.26,53.34 59.69,53.34 v60.96,52.07 | v19.05,54.61 E13.7 | v53.34,64.77 E19.5
N$54  (via drill 0.81)
  Top 0.406: v54.61,123.19 55.88,124.46 62.23,124.46 63.5,123.19 v63.5,106.68 60.96,104.14 60.96,55.88 v64.77,52.07
  Bottom 0.406: E9.7 41.91,100.33 E8.14 43.18,101.6 45.72,104.14 60.96,104.14 v63.5,106.68 | v54.61,123.19 E14.2 | E11.7 v64.77,52.07
N$55
  Bottom 0.406: E9.5 33.02,111.76 31.75,110.49 TP3.1 33.02,106.68 41.91,97.79 E8.13
N$56  (via drill 0.81)
  Top 0.406: v52.07,100.33 v52.07,109.22
  Bottom 0.406: v52.07,100.33 E10.8 | E9.10 49.53,111.76 v52.07,109.22
N$57
  Bottom 0.406: E3.5 86.36,49.53 86.36,54.61 81.28,59.69 74.93,59.69 71.12,63.5 71.12,67.31 67.31,71.12 67.31,77.47 63.5,81.28 49.53,81.28 45.72,85.09 45.72,88.9 44.45,90.17 E8.10
N$58
  Bottom 0.406: R1.2 R2.1 90.17,71.12 E15.13
N$59
  Bottom 0.406: R4.1 R3.2 90.17,2.54 33.02,2.54 27.94,7.62 27.94,13.97 29.21,15.24 29.21,19.05 25.4,22.86 E16.13
N$60
  Bottom 0.406: E3.3 86.36,41.91 87.63,43.18 87.63,55.88 82.55,60.96 74.93,60.96 72.39,63.5 72.39,67.31 68.58,71.12 68.58,77.47 63.5,82.55 49.53,82.55 46.99,85.09 46.99,93.98 45.72,95.25 E8.12
N$61  (via drill 0.81)
  Top 0.406: v49.53,86.36 49.53,93.98 46.99,96.52 46.99,107.95 v48.26,109.22
  Bottom 0.406: E10.13 50.8,87.63 v49.53,86.36 | E9.1 39.37,118.11 39.37,110.49 E9.8 45.72,106.68 v48.26,109.22 50.8,106.68 E14.7
N$62
  Bottom 0.406: E9.3 33.02,119.38 33.02,124.46 34.29,125.73 36.83,125.73 40.64,121.92 40.64,111.76 E9.9
N$63
  Bottom 0.406: E1.14 85.09,130.81 78.74,130.81 72.39,124.46 69.85,124.46 67.31,127 63.5,127 E14.1 58.42,123.19 55.88,125.73 53.34,125.73 52.07,124.46 52.07,123.19 49.53,120.65 44.45,120.65 E9.14
N$64
  Bottom 0.406: E1.1 86.36,121.92 86.36,119.38 87.63,118.11 87.63,102.87 85.09,100.33 R34.2
N$65
  Bottom 0.406: R34.1 93.98,101.6 | 93.98,101.6 R33.2 | 93.98,101.6 95.25,100.33 99.06,100.33 101.6,102.87 Q3.2
N$66  (via drill 0.81)
  Top 0.406: v39.37,105.41 36.83,102.87 TP7.1 31.75,92.71 29.21,90.17 29.21,83.82 25.4,80.01 25.4,77.47 26.67,76.2 26.67,60.96 22.86,57.15 19.05,57.15 17.78,55.88 17.78,53.34 19.05,52.07 26.67,52.07 30.48,48.26 30.48,38.1 31.75,36.83 31.75,30.48 26.67,25.4 26.67,10.16 24.13,7.62 21.59,7.62 17.78,11.43 17.78,26.67 16.51,27.94 15.24,27.94 12.7,25.4 v12.7,20.32 11.43,19.05 11.43,8.89 16.51,3.81 58.42,3.81 64.77,10.16 64.77,20.32 v63.5,21.59 | v68.58,99.06 69.85,100.33 v69.85,107.95
  Bottom 0.406: v63.5,21.59 E20.12 | E20.14 E20.13 E20.12 | 20.32,93.98 E17.12 | 20.32,93.98 20.32,91.44 E17.10 | TP7.1 30.48,104.14 25.4,104.14 20.32,99.06 20.32,93.98 | v39.37,105.41 59.69,105.41 60.96,106.68 60.96,107.95 62.23,109.22 63.5,109.22 E14.8 68.58,106.68 v69.85,107.95 69.85,110.49 68.58,111.76 E14.10 64.77,113.03 64.77,115.57 E14.12 E14.13 | E10.7 67.31,100.33 v68.58,99.06 | E20.9 E20.10 57.15,17.78 57.15,19.05 58.42,20.32 E20.12
  Bottom 0.813: v12.7,20.32 E16.3
  pour Bottom: 59.69,25.4 63.5,21.59 59.69,20.32
N$67
  Bottom 0.406: U$2.AH2 117.17,108.89 116.84,109.22 111.76,109.22 Q3.3
N$68  (via drill 0.81)
  Top 0.406: v73.66,83.82 73.66,81.28 69.85,77.47 69.85,71.12 71.12,69.85 71.12,57.15 68.58,54.61 68.58,35.56 v69.85,34.29 | v41.91,33.02 41.91,49.53 36.83,54.61 v25.4,54.61 | v54.61,33.02 57.15,30.48 58.42,30.48 60.96,33.02 v60.96,43.18
  Bottom 0.406: v69.85,34.29 66.04,38.1 E11.3 60.96,41.91 v60.96,43.18 | v60.96,43.18 E11.5 | E11.14 v54.61,33.02 49.53,27.94 45.72,27.94 41.91,31.75 v41.91,33.02 | E12.9 17.78,46.99 v25.4,54.61 25.4,63.5 24.13,64.77 E13.10 | E10.14 57.15,83.82 v73.66,83.82 | E11.8 60.96,44.45 v60.96,43.18
N$69  (via drill 0.81)
  Top 0.406: v64.77,5.08 67.31,5.08 71.12,8.89 71.12,30.48 67.31,34.29 TP2.1
  Bottom 0.406: TP2.1 E19.9 | E12.12 20.32,34.29 20.32,30.48 26.67,24.13 26.67,22.86 30.48,19.05 30.48,15.24 29.21,13.97 29.21,7.62 33.02,3.81 63.5,3.81 v64.77,5.08
N$71
  Bottom 0.406: C2.1 13.97,33.02 E12.14
N$72
  Bottom 0.406: R10.1 91.44,1.27 27.94,1.27 17.78,11.43 | 17.78,11.43 16.51,12.7 E16.6 | C2.2 19.05,12.7 17.78,11.43
N$73  (via drill 0.81)
  Top 0.406: v12.7,57.15 15.24,57.15 19.05,60.96 v19.05,63.5
  Bottom 0.406: E12.8 v12.7,57.15 | v19.05,63.5 E13.8
N$74
  Bottom 0.406: E13.14 25.4,74.93 27.94,77.47 27.94,81.28 25.4,83.82 E17.8
N$75
  Bottom 0.406: E13.13 25.4,72.39 29.21,76.2 29.21,82.55 25.4,86.36 E17.9
N$76
  Bottom 0.406: E18.13 21.59,120.65 W4.1
N$77
  Bottom 0.406: E13.3 17.78,72.39 17.78,74.93 13.97,78.74 11.43,78.74 10.16,80.01 10.16,82.55 11.43,83.82 E17.7
N$78  (via drill 0.81)
  Top 0.406: v104.14,97.79 105.41,99.06 105.41,116.84 102.87,119.38 102.87,128.27 100.33,130.81 19.05,130.81 10.16,121.92 10.16,76.2 8.89,74.93 8.89,69.85 10.16,68.58 10.16,41.91 11.43,40.64 13.97,40.64 13.97,33.02 16.51,33.02 20.32,36.83 v20.32,38.1
  Bottom 0.406: U$2.AM2 117.17,96.19 116.84,96.52 105.41,96.52 v104.14,97.79 | E12.5 20.32,44.45 19.05,43.18 19.05,39.37 v20.32,38.1 21.59,38.1 E12.3 26.67,39.37 27.94,40.64 27.94,68.58 26.67,69.85 E13.12
N$79
  Bottom 0.406: R8.1 R7.2 97.79,53.34 97.79,85.09 95.25,87.63 95.25,88.9 96.52,90.17 Q4.2
N$80  (via drill 0.81)
  Top 0.406: W6.1 24.13,109.22 24.13,104.14 20.32,100.33 20.32,60.96 16.51,57.15 16.51,53.34 20.32,49.53 v20.32,46.99
  Bottom 0.406: E18.3 16.51,116.84 19.05,114.3 19.05,111.76 21.59,109.22 E18.9 24.13,109.22 W6.1 | v20.32,46.99 E12.6
N$81  (via drill 0.81)
  Top 0.406: v63.5,77.47 v66.04,85.09
  Bottom 0.406: E19.14 v63.5,77.47 | v66.04,85.09 E10.1
N$82  (via drill 0.81)
  Top 0.406: W4.2 8.89,123.19 8.89,76.2 7.62,74.93 7.62,69.85 8.89,68.58 8.89,33.02 11.43,30.48 v26.67,30.48 | W3.2 29.21,46.99 v25.4,50.8
  Bottom 0.406: W3.2 29.21,33.02 v26.67,30.48 | E12.7 24.13,49.53 v25.4,50.8
N$83
  Bottom 0.406: U$2.BJ2 117.17,35.89 116.84,35.56 111.76,35.56 102.87,44.45 R7.1
N$84
  Bottom 0.406: U$2.AV2 117.23,74.05 116.84,73.66 104.14,73.66 R11.1
N$85  (via drill 0.81)
  Top 0.406: v19.05,80.01 19.05,101.6 20.32,102.87 20.32,127 21.59,128.27 66.04,128.27 72.39,121.92 72.39,97.79 v68.58,93.98
  Bottom 0.406: E13.9 20.32,64.77 20.32,78.74 v19.05,80.01 | E10.5 67.31,95.25 v68.58,93.98
N$86
  Bottom 0.406: R36.2 R35.2 99.06,97.79 Q2.2
N$87
  Bottom 0.406: U$2.AL2 117.17,99.39 116.84,99.06 106.68,100.33 Q2.3
N$88
  Bottom 0.406: U$2.AD2 117.14,118.42 116.84,118.11 109.22,118.11 Q1.3
N$89
  Bottom 0.406: D1.C R37.2 97.79,95.25 102.87,99.06 102.87,119.38 Q1.2
N$90
  Bottom 0.406: E1.3 85.09,118.11 85.09,107.95 82.55,105.41 81.28,105.41 77.47,101.6 77.47,96.52 82.55,91.44 D1.A
N$91
  Bottom 0.406: E1.2 85.09,120.65 85.09,119.38 86.36,118.11 86.36,107.95 82.55,104.14 81.28,104.14 78.74,101.6 78.74,99.06 R36.1
N$92  (via drill 0.81)
  Top 0.406: v72.39,88.9 74.93,91.44 74.93,121.92 v77.47,124.46
  Bottom 0.406: E1.12 88.9,121.92 88.9,124.46 85.09,128.27 81.28,128.27 v77.47,124.46 | E10.3 71.12,90.17 v72.39,88.9
N$93
  Bottom 0.406: E14.14 69.85,121.92 C19.2 R9.1
N$94  (via drill 0.81)
  Top 0.406: v15.24,101.6 16.51,100.33 16.51,82.55 15.24,81.28 v12.7,81.28 | v36.83,82.55 30.48,82.55 v26.67,78.74
  Bottom 0.406: E13.5 19.05,68.58 19.05,74.93 v12.7,81.28 16.51,81.28 19.05,83.82 | E17.5 19.05,85.09 19.05,83.82 | 19.05,83.82 24.13,78.74 v26.67,78.74 | v15.24,101.6 E17.1 | E19.1 55.88,77.47 54.61,78.74 50.8,78.74 48.26,76.2 43.18,76.2 v36.83,82.55
N$96  (via drill 0.81)
  Top 0.406: v21.59,54.61 27.94,60.96 27.94,73.66 35.56,81.28 v41.91,81.28
  Bottom 0.406: v21.59,54.61 E13.6 | E19.12 58.42,74.93 58.42,76.2 54.61,80.01 50.8,80.01 48.26,77.47 45.72,77.47 v41.91,81.28
N$97  (via drill 0.81)
  Top 0.406: v62.23,121.92 59.69,119.38 v59.69,78.74
  Bottom 0.406: E1.13 90.17,123.19 90.17,124.46 85.09,129.54 80.01,129.54 73.66,123.19 69.85,123.19 67.31,125.73 64.77,125.73 62.23,123.19 v62.23,121.92 | E19.13 59.69,76.2 v59.69,78.74
N$98
  Bottom 0.406: E18.1 15.24,123.19 20.32,128.27 26.67,128.27 29.21,125.73 29.21,110.49 25.4,106.68 E18.8
N$105
  Bottom 0.406: R5.2 R6.1 72.39,96.52 67.31,96.52 66.04,97.79 E10.6
NC
  pour NC$: 0,0 125.73,0 125.73,132.08 0,132.08
PWRCLR
  Bottom 0.406: U$2.BU2 117.2,7.26 116.84,7.62 111.76,7.62 R3.1
VCC  (via drill 0.81)
  Top 0.813: v104.14,107.95 v96.52,106.68 90.17,100.33 90.17,87.63 | 90.17,87.63 v99.06,87.63 | 90.17,87.63 86.36,83.82 v86.36,72.39 86.36,34.29 | 86.36,34.29 76.2,34.29 73.66,36.83 v73.66,44.45 | v90.17,22.86 90.17,30.48 86.36,34.29 | v63.5,17.78 63.5,11.43 57.15,5.08 44.45,5.08 v43.18,6.35 45.72,8.89 v45.72,17.78 45.72,25.4 49.53,29.21 v49.53,41.91 49.53,49.53 45.72,53.34 v45.72,67.31 v45.72,92.71 45.72,113.03 v46.99,114.3 45.72,115.57 45.72,125.73 | v25.4,17.78 25.4,26.67 29.21,30.48 26.67,33.02 | v26.67,43.18 26.67,33.02 | 26.67,33.02 25.4,31.75 12.7,31.75 v12.7,39.37 | 45.72,125.73 26.67,125.73 25.4,124.46 25.4,115.57 v26.67,114.3 29.21,111.76 25.4,107.95 25.4,102.87 24.64,102.11 24.64,92.2 v25.4,91.44 25.15,91.44 24.64,90.93 24.64,81.79 24.13,81.28 24.13,76.2 25.4,74.93 v25.4,67.31 | 45.72,125.73 64.77,125.73 68.58,121.92 68.58,114.3 | 68.58,114.3 68.58,105.41 v66.04,102.87 66.04,97.79 67.31,96.52 v67.31,67.31 | 68.58,114.3 v71.12,114.3
  Bottom 0.813: U$2.BV2 117.23,4.2 116.84,3.81 109.22,3.81 R10.2 104.14,8.89 104.14,11.43 | 104.14,11.43 R4.2 | 104.14,31.75 R20.2 | 104.14,26.67 104.14,21.59 | 104.14,31.75 104.14,26.67 | 104.14,16.51 104.14,11.43 | 104.14,21.59 104.14,16.51 | 104.14,26.67 R18.2 | 104.14,21.59 R22.2 | 104.14,16.51 R16.2 | 104.14,31.75 100.33,36.83 R30.2 R24.2 R8.2 R26.2 R28.2 R14.2 R2.2 R12.2 R6.2 R32.2 v99.06,87.63 | v96.52,106.68 96.52,113.03 E1.11 87.63,120.65 87.63,123.19 83.82,127 v71.12,114.3 | U$2.AJ2 117.17,105.74 116.84,105.41 106.68,105.41 v104.14,107.95 | v86.36,72.39 E15.11 | v73.66,44.45 E3.11 | v90.17,22.86 E2.11 | v63.5,17.78 E4.11 | v49.53,41.91 E6.11 | v12.7,39.37 E12.11 | v25.4,91.44 E17.11 | v26.67,114.3 E18.11 | E5.5 33.02,15.24 30.48,12.7 30.48,8.89 33.02,6.35 v43.18,6.35 | v46.99,114.3 E9.11 | E13.11 v25.4,67.31 26.67,66.04 v26.67,43.18 | v45.72,67.31 E7.11 | E19.3 E19.11 v67.31,67.31 | v45.72,92.71 E8.11 | E10.11 58.42,92.71 59.69,93.98 59.69,99.06 63.5,102.87 v66.04,102.87 | v25.4,17.78 E16.11 | v45.72,17.78 E5.11

### Text on the board
Bottom: TELETYPE TRANSMITTER W707L
tDocu: Do not manufacture NC layer.